# Altium schematic sheet Relay.SchDoc
size 88 x 76 mm
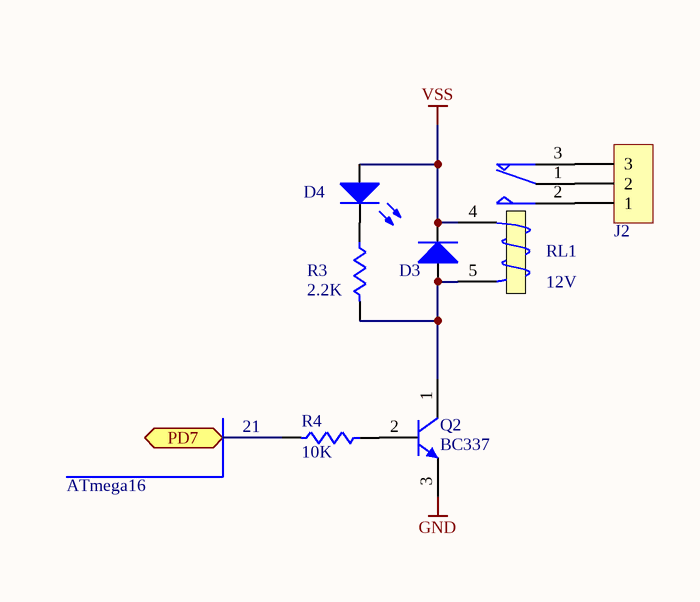
[diagram p0: Relay.SchDoc]

## Parts
D3  Diode  [DIODE0.35]  (value not drawn)
D4  Optical Transmitter  [LED_5mm]  (value not drawn)
J2  Connector_3pin  [Fonics_3C]  (value not drawn)
Q2  Device: BC337  [TO92C]  (hidden comment: NPN)
R3  value 2.2K  [AXIAL0.4]  (hidden comment: Resistor)
R4  value 10K  [AXIAL0.4]  (hidden comment: Resistor)
RL1  value 12V  [RELAY-SPDT-1]  (hidden comment: Relay_SPDT)

## Ports
PD7

## Nets
GND: Q2.3(E)
VSS: D3.2(K) D4.1(A) RL1.4(T1)
PD7: R4.2 ; port PD7
NetD3_1: D3.1(A) Q2.1(C) R3.2 RL1.5(T2)
NetD4_2: D4.2(K) R3.1
NetJ2_1: J2.1 RL1.2(NO)
NetJ2_2: J2.2 RL1.1(COM)
NetJ2_3: J2.3 RL1.3(NC)
NetQ2_2: Q2.2(B) R4.1

## Notes on the sheet
- (near R4) 21
- ATmega16

## Library data of the parts
D3 = Diode: Manufacturer: Generic Components; Class I: Discrete; Class II: Diode - Switching; Published: 8-Jun-2000; Revision: July-2002: Re-released for DXP Platform.; Publisher: Altium Limited
D4 = Optical Transmitter: Typical INFRARED GaAs LED; Manufacturer: Generic Components; Class I: Optoelectronic; Published: 8-Jun-2000; Revision: July-2002: Re-released for DXP Platform.; Publisher: Altium Limited; Class II: LED
J2 = Connector_3pin: Header, 3-Pin; Manufacturer: Generic Components; Revision: July-2002: Re-released for DXP Platform.; Publisher: Altium Limited; Class I: Connector
Q2 = NPN: Silicon Bipolar Transistor; Package Reference: TO-92A
R3 R4 = Resistor: Manufacturer: Generic Components; Revision: July-2002: Re-released for DXP Platform.; Publisher: Altium Limited
RL1 = Relay_SPDT: SPDT Relay; Manufacturer: Generic Components; Class I: Electro-mechanical; Published: 8-Jun-2000; Revision: July-2002: Re-released for DXP Platform.; Publisher: Altium Limited; Class II: Relay